# Altium schematic sheet Alimentacion.SchDoc
size A4
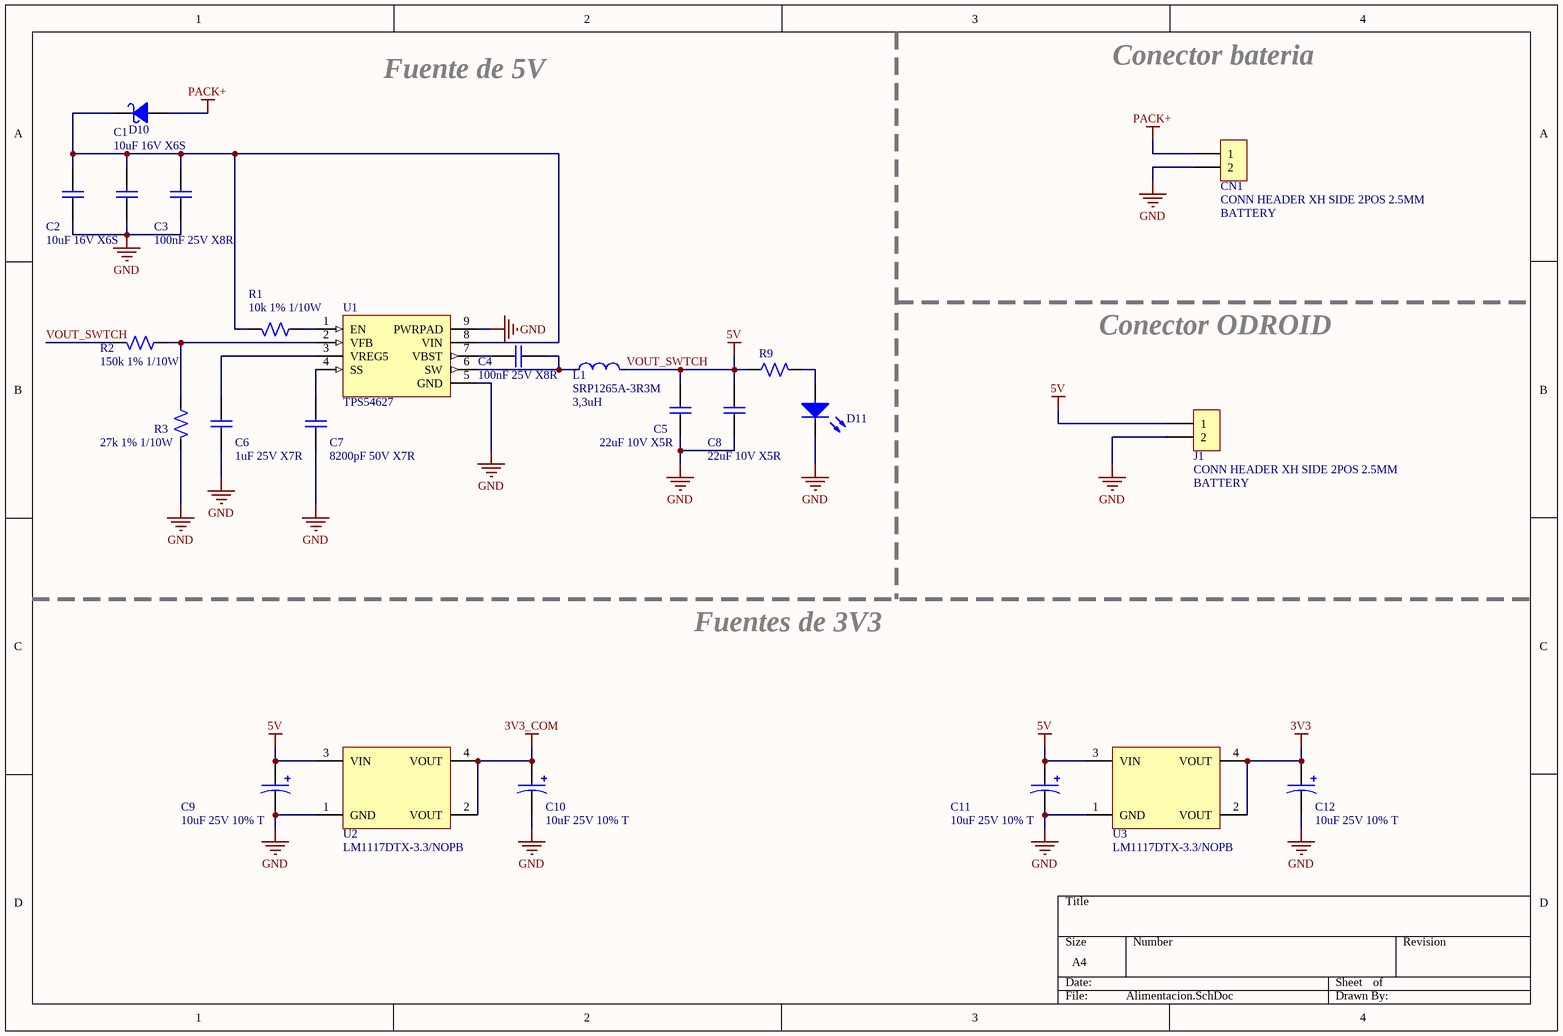
[diagram p0: Alimentacion.SchDoc]

## Parts
C1  10uF 16V X6S  [C1206]
C2  10uF 16V X6S  [C1206]
C3  100nF 25V X8R  [C1206]
C4  100nF 25V X8R  [C0603]
C5  22uF 10V X5R  [C1206]
C6  1uF 25V X7R  [C0603]
C7  8200pF 50V X7R  [C0603]
C8  22uF 10V X5R  [C1206]
C9  10uF 25V 10% T  [AVX_C]
C10  10uF 25V 10% T  [AVX_C]
C11  10uF 25V 10% T  [AVX_C]
C12  10uF 25V 10% T  [AVX_C]
CN1  CONN HEADER XH SIDE 2POS 2.5MM  [S2B-XH-A]
D10  Schottky  [SMC (DO-214AB)]  (value not drawn)
D11  Led  [LED_0805]  (value not drawn)
J1  CONN HEADER XH SIDE 2POS 2.5MM  [5V_OUT]
L1  SRP1265A-3R3M  Valor: 3,3uH  [SRP1265A]
R1  10k 1% 1/10W  [R0603]
R2  150k 1% 1/10W  [R0603]
R3  27k 1% 1/10W  [R0603]
R9  (no value)  [R0603]
U1  TPS54627  [HSOP-8]
U2  LM1117DTX-3.3/NOPB  [DPAK]
U3  LM1117DTX-3.3/NOPB  [DPAK]

## Nets
3V3: C12.1 U3.2(VOUT) U3.4(VOUT)
3V3_COM: C10.1 U2.2(VOUT) U2.4(VOUT)
GND: C1.2 C2.2 C3.2 C5.2 C6.2 C7.2 C8.2 C9.2 C10.2 C11.2 C12.2 CN1.2 D11.2 J1.2 R3.2 U1.5(GND) U1.9(PWRPAD) U2.1(GND) U3.1(GND)
PACK+: CN1.1 D10.1
VOUT_SWTCH: C5.1 C8.1 C9.1 C11.1 J1.1 L1.2 R2.2 R9.1 U2.3(VIN) U3.3(VIN)  [also labelled 5V]
NetC1_1: C1.1 C2.1 C3.1 D10.2 R1.2 U1.8(VIN)
NetC4_1: C4.1 U1.7(VBST)
NetC4_2: C4.2 L1.1 U1.6(SW)
NetC6_1: C6.1 U1.3(VREG5)
NetC7_1: C7.1 U1.4(SS)
NetD11_1: D11.1 R9.2
NetR1_1: R1.1 U1.1(EN)
NetR2_1: R2.1 R3.1 U1.2(VFB)

## Notes on the sheet
- Fuente de 5V
- Conector bateria
- Conector ODROID
- Fuentes de 3V3
- (in symbol Header_2) BATTERY

## Library data of the parts
C1 C2 = Capacitor: Capacitor de placas paralelas; Proveedor: Mouser; Cod. Proveedor: 81-GRM188C81C106MA3D; Encapsulado: MODIFICAR; Valor: 10uF; Link: https://ar.mouser.com/
C3 = Capacitor: Capacitor de placas paralelas; Proveedor: Mouser; Cod. Proveedor: 810-C1608X8R1E104K; Encapsulado: MODIFICAR; Valor: 100nF; Link: https://ar.mouser.com
C4 = Capacitor: Capacitor de placas paralelas; Proveedor: Mouser; Cod. Proveedor: 810-C1608X8R1E104K; Encapsulado: C0603; Valor: 100nF; Link: https://ar.mouser.com
C5 C8 = Capacitor: Capacitor de placas paralelas; Proveedor: Mouser; Cod. Proveedor: 81-ZRB18AR61A226ME1L; Encapsulado: MODIFICAR; Valor: 22uF; Link: https://ar.mouser.com/
C6 = Capacitor: Capacitor de placas paralelas; Proveedor: Mouser; Cod. Proveedor: 810-C1608X7R1E105KAE; Encapsulado: C0603; Valor: 1uF; Link: https://ar.mouser.com
C7 = Capacitor: Capacitor de placas paralelas; Proveedor: Mouser; Cod. Proveedor: 77-VJ0603Y822KXAPBC; Encapsulado: C0603; Valor: 8200pF; Link: https://ar.mouser.com
C9-C12 = CapaPol: Capacitor polarizado; Cod. Proveedor: 80-T491C106K25AT7280; Proveedor: Mouser; Encapsulado: AVX C Case; Valor: 10uF; Link: https://ar.mouser.com/
CN1 J1 = Header_2: Header, 2-pin; Cod. Proveedor: 455-2257-ND; Proveedor: Digikey; Encapsulado: Through Hole; Link: https://www.digikey.com
D10 = Schottky: Diodo Schottky
D11 = Led: Diodo Led
L1 = Inductor: Proveedor: Mouser; Encapsulado: SMD; Cod. Proveedor: 652-SRP1265A-3R3M; Link: https://ar.mouser.com
R1 = Resistor: Resistencia; Cod. Proveedor: 71-CRCW060310K0FKEAC; Proveedor: Mouser; Encapsulado: R0603; Valor: 10k; Link: https://ar.mouser.com
R2 = Resistor: Resistencia; Cod. Proveedor: 603-RC0603FR-07150KL; Proveedor: Mouser; Encapsulado: R0603; Valor: 150k; Link: https://ar.mouser.com
R3 = Resistor: Resistencia; Cod. Proveedor: 603-RC0603FR-1327KL; Proveedor: Mouser; Encapsulado: R0603; Valor: 27k; Link: http://www.elemon.net/
R9 = Resistor: Resistencia; Cod. Proveedor: 603-RC0603FR-10470RL; Proveedor: Mouser; Valor: 470E; Encapsulado: R0603; Link: https://ar.mouser.com
U1 = TPS54627: 4.5-V to 18-V Input, 6-A Synchronous Step-Down Converter; Proveedor: Mouser; Cod. Proveedor: 595-TPS54627DDAR; Encapsulado: HSOP-8; Link: https://ar.mouser.com
U2 U3 = LM1117: Low dropout oscilator; Cod. Proveedor: CI2707214D; Proveedor: Elemon; Encapsulado: TO-252-3; Link: http://www.elemon.net/